# EAGLE design HA LCD1.14 V1.1 (EAGLE 6.1)
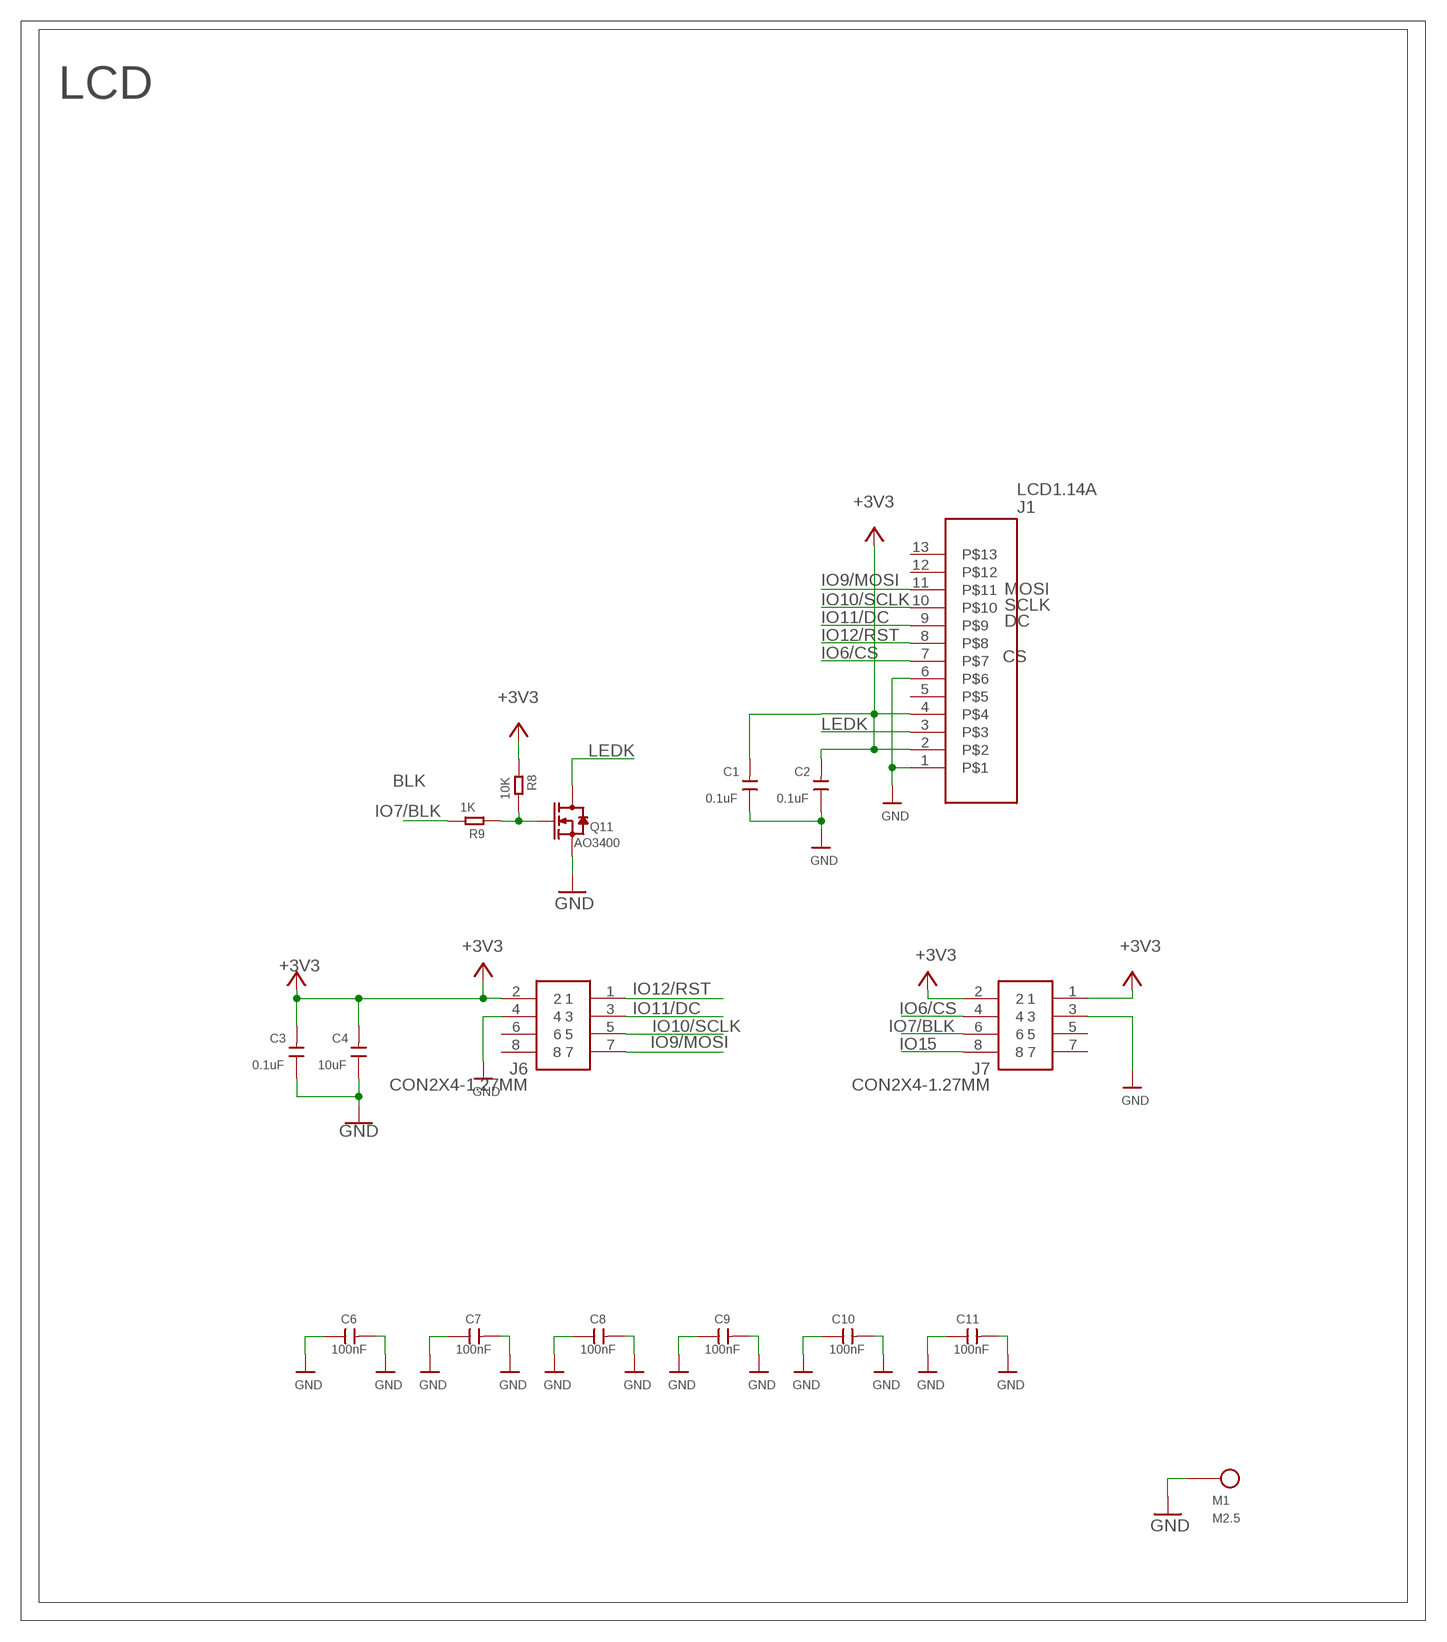
[diagram p0: schematic, sheet 1]

## Parts
C1  0.1uF  DISCRETE_C-0402  [DISCRETE_C0402]
C2  0.1uF  DISCRETE_C-0402  [DISCRETE_C0402]
C3  0.1uF  DISCRETE_C-0402  [DISCRETE_C0402]
C4  10uF  DISCRETE_C-0402  [DISCRETE_C0402]
C6  100nF  C-0603  [0603]
C7  100nF  C-0603  [0603]
C8  100nF  C-0603  [0603]
C9  100nF  C-0603  [0603]
C10  100nF  C-0603  [0603]
C11  100nF  C-0603  [0603]
J1  LCD1.14A  [LCD1.14A]
J6  CON2X4-1.27MM  [CON2X4-1.27MM]
J7  CON2X4-1.27MM  [CON2X4-1.27MM]
M1  M2.5  [M2.5]
Q11  AO3400  MOSFET-N'SOT23'  [SOT23]
R8  10K  DISCRETE_R-0402  [DISCRETE_R0402]
R9  1K  DISCRETE_R-0402  [DISCRETE_R0402]

## Nets
+3V3: C1.2 C2.2 C3.2 C4.2 J1.2 J1.4 J6.2 J7.1 J7.2 R8.1
GND: C1.1 C2.1 C3.1 C4.1 C6.1 C6.2 C7.1 C7.2 C8.1 C8.2 C9.1 C9.2 C10.1 C10.2 C11.1 C11.2 J1.1 J1.6 J6.4 J7.3 M1.1 Q11.2(S)
IO6/CS: J1.7 J7.4
IO7/BLK: J7.6 R9.2
IO9/MOSI: J1.11 J6.7
IO10/SCLK: J1.10 J6.5
IO11/DC: J1.9 J6.3
IO12/RST: J1.8 J6.1
IO15: J7.8
LEDK: J1.3 Q11.3(D)
N$25: Q11.1(G) R8.2 R9.1
Unconnected: J1.5 J1.12 J1.13 J6.6 J6.8 J7.5 J7.7

## Notes on the sheet
- LCD
- MOSI
- SCLK
- DC
- CS
- BLK

## Library data of the parts
C1-C4 = A9G:DISCRETE_C*: Ceramic Capacitors
C6-C11 = Discrete:C*: Ceramic Capacitors
J1 = user:LCD1.14A
J6 J7 = user:CON2X4-1.27MM
M1 = sale:M2.5
Q11 = Discrete:MOSFET-N: IRLL014: http://www.vishay.com/docs/91319/sihll014.pdf
R8 R9 = A9G:DISCRETE_R*

## Net classes
0 default: width 0.203 mm, drill 0.305 mm, clearance 0.152 mm
2 gnd: width 0.305 mm, drill 0.559 mm, clearance 0.254 mm
3 usbvcc: width 0.508 mm, drill 0.61 mm, clearance 0.254 mm
4 USBpair: width 0.254 mm, drill 0.406 mm, clearance 0.406 mm

## Board
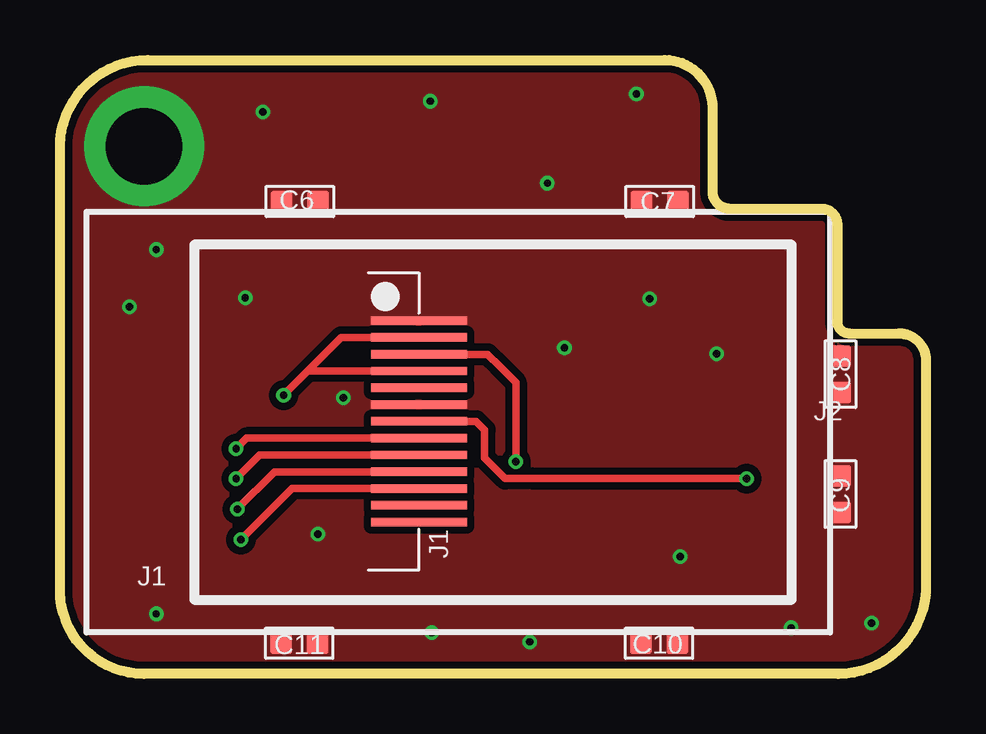
[diagram p1: board, top side]
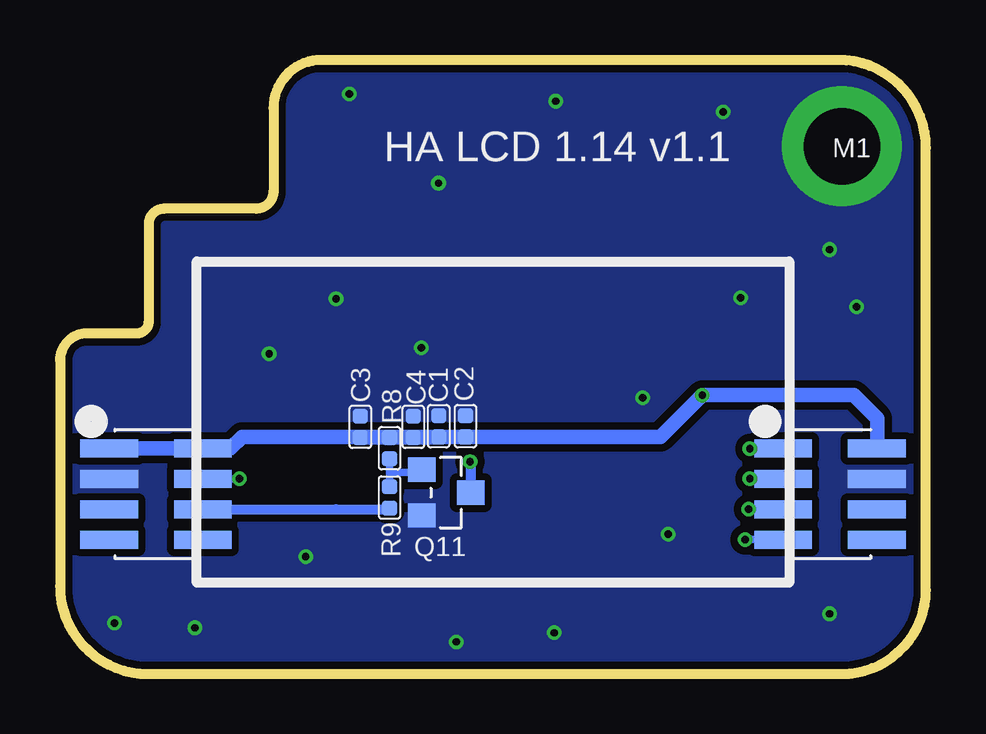
[diagram p2: board, bottom side, seen from below]

Size 36.1 x 25.6 mm. Coordinates in mm from the lower left corner, seen from the top.
Outline: 32.43,0 3.5,0 arc-90 0,3.5 0,21.93 arc-90 3.67,25.6 25.21,25.6 arc-90 27.2,23.61 27.2,20.12 arc90 27.92,19.4 31.76,19.4 arc-90 32.4,18.76 32.4,14.7 arc90 32.9,14.2 34.98,14.2 arc-90 36.1,13.08 36.1,3.67 arc-90 32.43,0
Copper layers (1*16): Top 0.035mm / dielectric 1.5mm / Bottom 0.035mm
Design rules: minimum track width 6mil, minimum drill 8mil, track to track 6mil, track to pad 6mil, pad to pad 6mil, via to via 6mil, smd to smd 0mil, copper to edge 10mil, drill to drill 10mil, minimum pad ring 4mil, minimum via ring 6mil, stop-mask expansion 2mil, vias tented up to drill 30mil, thermal gap 0mil

### Footprints (pad centres in the part's own frame; a part is rotated, then mirrored left to right if it is on the bottom)
DISCRETE_C0402 = smd 0.635 x 0.635: 1 -0.445,0; 2 0.445,0
0603 = smd 0.889 x 0.889: 1 -0.762,0; 2 0.762,0
LCD1.14A = smd 4 x 0.35: 1 0,4.2; 2 0,3.5; 3 0,2.8; 4 0,2.1; 5 0,1.4; 6 0,0.7; 7 0,0; 8 0,-0.7; 9 0,-1.4; 10 0,-2.1; 11 0,-2.8; 12 0,-3.5; 13 0,-4.2
CON2X4-1.27MM = smd 0.75 x 2.4: 1 -1.905,-1.95; 2 -1.905,1.95; 3 -0.635,-1.95; 4 -0.635,1.95; 5 0.635,-1.95; 6 0.635,1.95; 7 1.905,-1.95; 8 1.905,1.95
M2.5 = drill 3.2 pad 5: 1 0,0
SOT23 = smd 1.016 x 1.143: 1 -0.95,-1.016; 2 0.95,-1.016; 3 0,1.016
DISCRETE_R0402 = smd 0.635 x 0.635: 1 -0.445,0; 2 0.445,0

### Placement (x,y rotation side)
C1  20.31,10.33 270 bottom
C2  19.19,10.33 270 bottom
C3  23.58,10.3 270 bottom
C4  21.37,10.3 270 bottom
C6  10,19.7 0 top
C7  25,19.7 0 top
C8  32.54,12.5 90 top
C9  32.54,7.5 90 top
C10  24.97,1.29 0 top
C11  9.97,1.29 180 top
J1  14.96,10.53 0 top
J6  4,7.5 270 bottom
J7  32.1,7.5 270 bottom
M1  3.5,22 0 bottom
Q11  20,7.56 270 bottom
R8  22.36,9.41 270 bottom
R9  22.36,7.36 270 bottom

### Tracks (layer width: path | path; a pad name or v marks a point on that pad's centre or on a via)
+3V3  (via drill 0.3)
  Top 0.305: J1.4 10.33,12.63 | 10.33,12.63 v9.32,11.62 | J1.2 11.73,14.03 10.33,12.63
  Bottom 0.61: C1.2 C2.2 11.06,9.88 v9.32,11.62 7.7,11.62 3,11.62 2.03,10.66 2.03,9.42 J6.2 | J7.1 J7.2 30.1,9.4 29,9.4 28.52,9.88 21.5,9.88 | C1.2 21.5,9.88 | C3.2 R8.1 | R8.1 C4.2 | C4.2 20.44,9.86 | 20.44,9.86 20.4,9.9 | 20.4,9.9 20.33,9.9 C1.2 | 20.44,9.86 20.4,9.9 | C4.2 21.48,9.86 21.5,9.88 | 21.5,9.88 22.34,9.88 R8.1
GND  (via drill 0.3)
  other vias: 25.86,4.89 27.38,13.35 21.03,13.6 7.72,15.69 2.9,15.31 4.01,2.5 19.58,1.34 15.49,1.72 4.01,17.69 20.32,20.46 8.46,23.43 24.03,24.18 24.59,15.64 33.83,2.12 30.48,1.92 10.74,5.83 11.81,11.52 15.43,23.88
  pour Bottom (isolate 0.305, rank 6): -6,-16.5 46,-16.5 46,35.5 -6,35.5
  pour Top (isolate 0.305, rank 6): -5,-15.5 40,-15.5 40,29.5 -5,29.5
IO6/CS  (via drill 0.3)
  Top 0.305: v28.63,8.14 19.74,8.14 18.56,8.14 17.7,9 17.7,10.18 17.35,10.53 J1.7
  Bottom 0.305: v28.63,8.14 J7.4
IO7/BLK
  Bottom 0.406: J7.6 24.61,6.86 22.36,6.86 R9.2
IO9/MOSI  (via drill 0.3)
  Top 0.305: J1.11 9.67,7.73 v7.54,5.6
  Bottom 0.305: v7.54,5.6 5.96,5.6 J6.7
IO10/SCLK  (via drill 0.3)
  Top 0.305: J1.10 8.95,8.43 v7.39,6.87
  Bottom 0.305: v7.39,6.87 5.96,6.87 J6.5
IO11/DC  (via drill 0.3)
  Top 0.305: J1.9 8.33,9.13 v7.34,8.14
  Bottom 0.305: v7.34,8.14 J6.3
IO12/RST  (via drill 0.3)
  Top 0.305: J1.8 7.78,9.83 v7.34,9.39
  Bottom 0.305: v7.34,9.39 5.97,9.39 J6.1
LEDK  (via drill 0.3)
  Top 0.305: J1.3 17.83,13.32 18.34,12.82 19.01,12.15 v19.01,8.86
  Bottom 0.406: v19.01,8.86 18.98,8.86 Q11.3
N$25
  Bottom 0.305: R8.2 22.36,8.4 | 22.36,8.4 R9.1 | Q11.1 21.12,8.4 22.36,8.4

### Text on the board
tPlace: J2 | J1
bPlace: HA LCD 1.14 v1.1